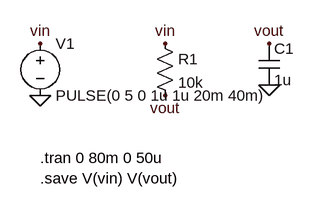
[diagram p0: schematic rc_constante_tiempo.asc]
rc_constante_tiempo.asc, the LTspice schematic file:
Version 4
SHEET 1 880 680
SYMBOL voltage 48 80 R0
SYMATTR InstName V1
SYMATTR Value PULSE(0 5 0 1u 1u 20m 40m)
SYMBOL res 224 80 R0
SYMATTR InstName R1
SYMATTR Value 10k
SYMBOL cap 384 96 R0
SYMATTR InstName C1
SYMATTR Value 1u
FLAG 48 96 vin
FLAG 48 176 0
FLAG 240 96 vin
FLAG 240 176 vout
FLAG 400 96 vout
FLAG 400 160 0
TEXT 48 272 Left 2 !.tran 0 80m 0 50u
TEXT 48 304 Left 2 !.save V(vin) V(vout)

The netlist it stands for:
* rc_constante_tiempo.asc
V1 vin 0 PULSE(0 5 0 1u 1u 20m 40m)
R1 vin vout 10k
C1 vout 0 1u
.tran 0 80m 0 50u
.save V(vin) V(vout)
.backanno
.end